# Altium schematic sheet CPU_GPIOA_F.SchDoc
size A4; Date: 2022-09-01; SheetNumber: 1; SheetTotal: 8
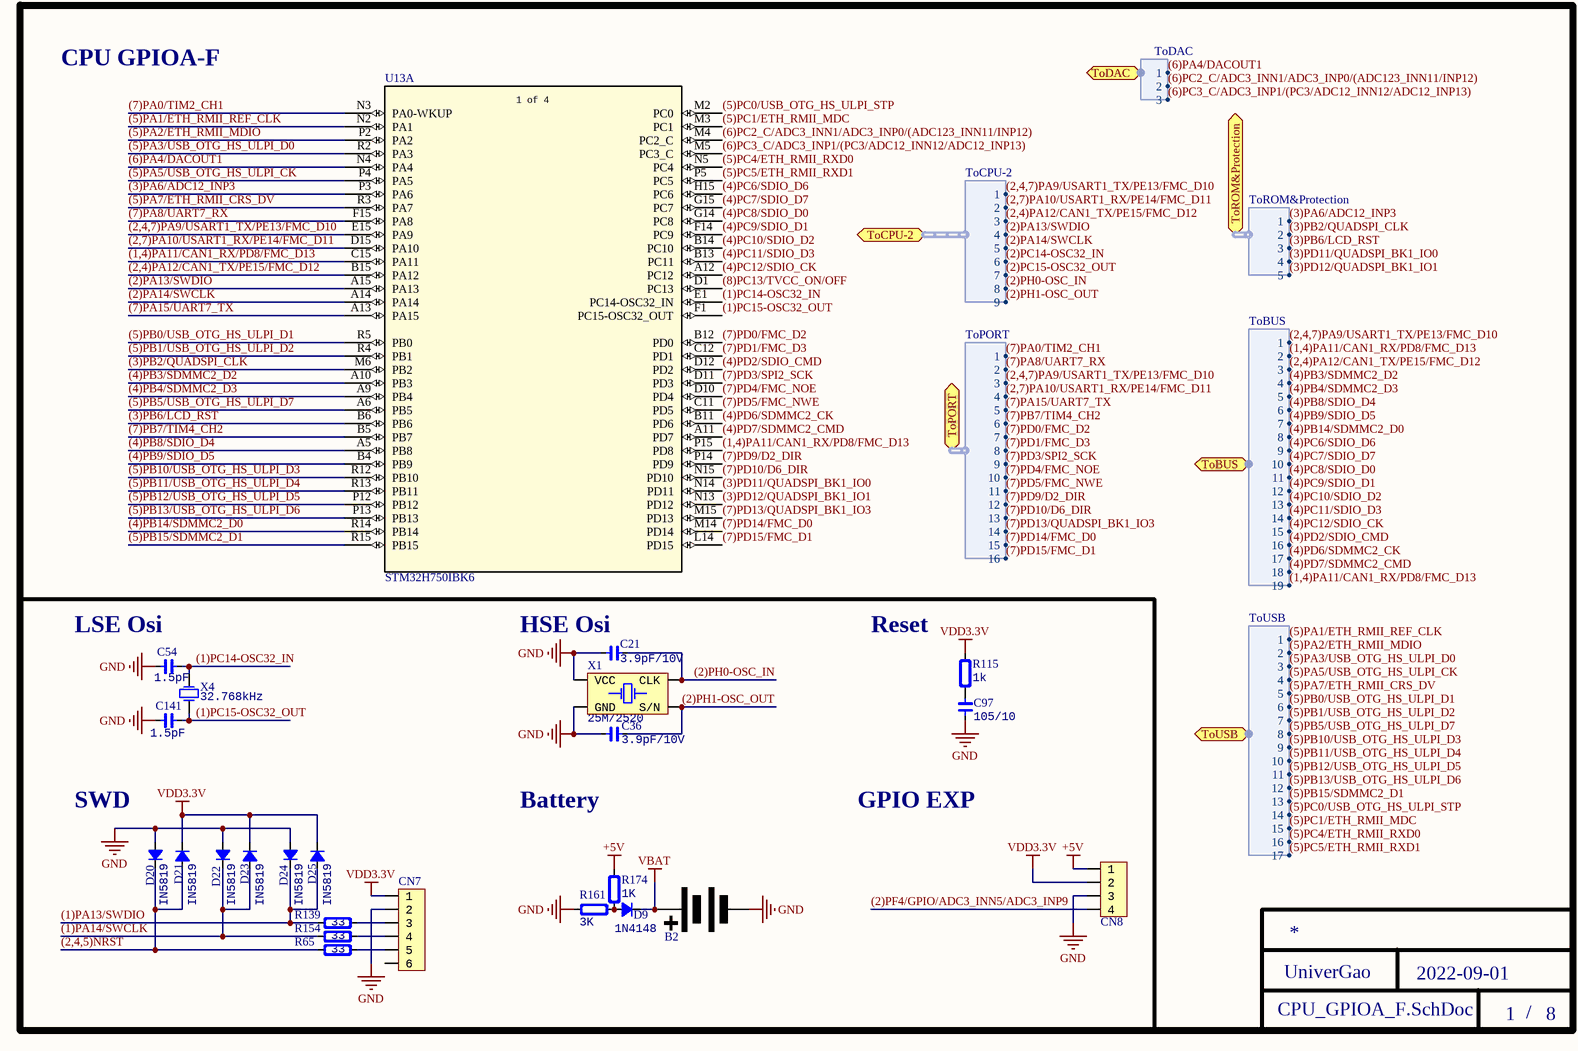
[diagram p0: CPU_GPIOA_F.SchDoc]

## Parts
B2  Battery  [CR2032-1]  (value not drawn)
C21  value 3.9pF/10V  [CAP_0603]  (hidden comment: C0603)
C36  value 3.9pF/10V  [CAP_0603]  (hidden comment: C0603)
C54  value 1.5pF  [CAP_0603]  (hidden comment: C0603)
C97  value 105/10  [CAP_0603]  (hidden comment: C0603)
C141  value 1.5pF  [CAP_0603]  (hidden comment: C0603)
CN7  HDR1x6  [HDR1X6_1.27_180]  (value not drawn)
CN8  HDR1x4  [HDR1X4_1.27_180]  (value not drawn)
D9  1N4148  [DO-214AC]
D20  (no value)  [SOD-323]
D21  (no value)  [SOD-323]
D22  (no value)  [SOD-323]
D23  (no value)  [SOD-323]
D24  (no value)  [SOD-323]
D25  (no value)  [SOD-323]
R65  value 33  [RES_0603]  (hidden comment: R0603)
R115  value 1k  [RES_0603]  (hidden comment: R0603)
R139  value 33  [RES_0603]  (hidden comment: R0603)
R154  value 33  [RES_0603]  (hidden comment: R0603)
R161  value 3K  [RES_0603]  (hidden comment: R0603)
R174  value 1K  [RES_0603]  (hidden comment: R0603)
U13  STM32H750IBK6  [UFBGA 10X10 P 0.65 176+25]  (part A of 4)
X1  value 25M/2520  [XT_2520_4]  (hidden comment: OSC2520)
X4  value 32.768kHz  [XT_2012_2]  (hidden comment: XTAL2012)

## Ports
ToBUS (harness ToBUS), ToCPU-2 (harness ToCPU-2), ToDAC (harness ToDAC), ToPORT (harness ToPORT), ToROM&Protection (harness ToROM&Protection), ToUSB (harness ToUSB)

## Harnesses
ToCPU-2: 1, 2, 3, 4, 5, 6, 7, 8, 9
ToROM&Protection: 1, 2, 3, 4, 5
ToBUS: 1, 2, 3, 4, 5, 6, 7, 8, 9, 10, 11, 12, 13, 14, 15, 16, 17, 18, 19
ToUSB: 1, 2, 3, 4, 5, 6, 7, 8, 9, 10, 11, 12, 13, 14, 15, 16, 17
ToDAC: 1, 2, 3
ToPORT: 1, 2, 3, 4, 5, 6, 7, 8, 9, 10, 11, 12, 13, 14, 15, 16

## Nets
+5V: CN8.1 R174.2
GND: B2.1(-) C21.1 C36.1 C54.1 C97.1 C141.1 CN7.2 CN8.3 D20.1(A) D22.1(A) D24.1(A) R161.2 X1.2(GND) X1.4(VCC)
VBAT: B2.2(+) D9.2(K)
VDD3.3V: CN7.1 CN8.2 D21.2(K) D23.2(K) D25.2(K) R115.2
(1)PA13/SWDIO: D24.2(K) D25.1(A) R139.1
(1)PA14/SWCLK: D22.2(K) D23.1(A) R154.1
(1)PC14-OSC32_IN: C54.2 U13.E1(PC14-OSC32_IN) X4.2(OSC2)
(1)PC15-OSC32_OUT: C141.2 U13.F1(PC15-OSC32_OUT) X4.1(OSC1)
(1,4)PA11/CAN1_RX/PD8/FMC_D13: U13.C15(PA11) U13.P15(PD8) ; port ToBUS.2, port ToBUS.19
(2)PA13/SWDIO: U13.A15(PA13) ; port ToCPU-2.4
(2)PA14/SWCLK: U13.A14(PA14) ; port ToCPU-2.5
(2)PC14-OSC32_IN: port ToCPU-2.6
(2)PC15-OSC32_OUT: port ToCPU-2.7
(2)PF4/GPIO/ADC3_INN5/ADC3_INP9: CN8.4
(2)PH0-OSC_IN: C21.2 X1.3(CLK) ; port ToCPU-2.8
(2)PH1-OSC_OUT: C36.2 X1.1(S/N) ; port ToCPU-2.9
(2,4)PA12/CAN1_TX/PE15/FMC_D12: U13.B15(PA12) ; port ToCPU-2.3, port ToBUS.3
(2,4,5)NRST: D20.2(K) D21.1(A) R65.1
(2,4,7)PA9/USART1_TX/PE13/FMC_D10: U13.E15(PA9) ; port ToCPU-2.1, port ToBUS.1, port ToPORT.3
(2,7)PA10/USART1_RX/PE14/FMC_D11: U13.D15(PA10) ; port ToCPU-2.2, port ToPORT.4
(3)PA6/ADC12_INP3: U13.P3(PA6) ; port ToROM&Protection.1
(3)PB2/QUADSPI_CLK: U13.M6(PB2) ; port ToROM&Protection.2
(3)PB6/LCD_RST: U13.B6(PB6) ; port ToROM&Protection.3
(3)PD11/QUADSPI_BK1_IO0: U13.N14(PD11) ; port ToROM&Protection.4
(3)PD12/QUADSPI_BK1_IO1: U13.N13(PD12) ; port ToROM&Protection.5
(4)PB3/SDMMC2_D2: U13.A10(PB3) ; port ToBUS.4
(4)PB4/SDMMC2_D3: U13.A9(PB4) ; port ToBUS.5
(4)PB8/SDIO_D4: U13.A5(PB8) ; port ToBUS.6
(4)PB9/SDIO_D5: U13.B4(PB9) ; port ToBUS.7
(4)PB14/SDMMC2_D0: U13.R14(PB14) ; port ToBUS.8
(4)PC6/SDIO_D6: U13.H15(PC6) ; port ToBUS.9
(4)PC7/SDIO_D7: U13.G15(PC7) ; port ToBUS.10
(4)PC8/SDIO_D0: U13.G14(PC8) ; port ToBUS.11
(4)PC9/SDIO_D1: U13.F14(PC9) ; port ToBUS.12
(4)PC10/SDIO_D2: U13.B14(PC10) ; port ToBUS.13
(4)PC11/SDIO_D3: U13.B13(PC11) ; port ToBUS.14
(4)PC12/SDIO_CK: U13.A12(PC12) ; port ToBUS.15
(4)PD2/SDIO_CMD: U13.D12(PD2) ; port ToBUS.16
(4)PD6/SDMMC2_CK: U13.B11(PD6) ; port ToBUS.17
(4)PD7/SDMMC2_CMD: U13.A11(PD7) ; port ToBUS.18
(5)PA1/ETH_RMII_REF_CLK: U13.N2(PA1) ; port ToUSB.1
(5)PA2/ETH_RMII_MDIO: U13.P2(PA2) ; port ToUSB.2
(5)PA3/USB_OTG_HS_ULPI_D0: U13.R2(PA3) ; port ToUSB.3
(5)PA5/USB_OTG_HS_ULPI_CK: U13.P4(PA5) ; port ToUSB.4
(5)PA7/ETH_RMII_CRS_DV: U13.R3(PA7) ; port ToUSB.5
(5)PB0/USB_OTG_HS_ULPI_D1: U13.R5(PB0) ; port ToUSB.6
(5)PB1/USB_OTG_HS_ULPI_D2: U13.R4(PB1) ; port ToUSB.7
(5)PB5/USB_OTG_HS_ULPI_D7: U13.A6(PB5) ; port ToUSB.8
(5)PB10/USB_OTG_HS_ULPI_D3: U13.R12(PB10) ; port ToUSB.9
(5)PB11/USB_OTG_HS_ULPI_D4: U13.R13(PB11) ; port ToUSB.10
(5)PB12/USB_OTG_HS_ULPI_D5: U13.P12(PB12) ; port ToUSB.11
(5)PB13/USB_OTG_HS_ULPI_D6: U13.P13(PB13) ; port ToUSB.12
(5)PB15/SDMMC2_D1: U13.R15(PB15) ; port ToUSB.13
(5)PC0/USB_OTG_HS_ULPI_STP: U13.M2(PC0) ; port ToUSB.14
(5)PC1/ETH_RMII_MDC: U13.M3(PC1) ; port ToUSB.15
(5)PC4/ETH_RMII_RXD0: U13.N5(PC4) ; port ToUSB.16
(5)PC5/ETH_RMII_RXD1: U13.P5(PC5) ; port ToUSB.17
(6)PA4/DACOUT1: U13.N4(PA4) ; port ToDAC.1
(6)PC2_C/ADC3_INN1/ADC3_INP0/(ADC123_INN11/INP12): U13.M4(PC2_C) ; port ToDAC.2
(6)PC3_C/ADC3_INP1/(PC3/ADC12_INN12/ADC12_INP13): U13.M5(PC3_C) ; port ToDAC.3
(7)PA0/TIM2_CH1: U13.N3(PA0-WKUP) ; port ToPORT.1
(7)PA8/UART7_RX: U13.F15(PA8) ; port ToPORT.2
(7)PA15/UART7_TX: U13.A13(PA15) ; port ToPORT.5
(7)PB7/TIM4_CH2: U13.B5(PB7) ; port ToPORT.6
(7)PD0/FMC_D2: U13.B12(PD0) ; port ToPORT.7
(7)PD1/FMC_D3: U13.C12(PD1) ; port ToPORT.8
(7)PD3/SPI2_SCK: U13.D11(PD3) ; port ToPORT.9
(7)PD4/FMC_NOE: U13.D10(PD4) ; port ToPORT.10
(7)PD5/FMC_NWE: U13.C11(PD5) ; port ToPORT.11
(7)PD9/D2_DIR: U13.P14(PD9) ; port ToPORT.12
(7)PD10/D6_DIR: U13.N15(PD10) ; port ToPORT.13
(7)PD13/QUADSPI_BK1_IO3: U13.M15(PD13) ; port ToPORT.14
(7)PD14/FMC_D0: U13.M14(PD14) ; port ToPORT.15
(7)PD15/FMC_D1: U13.L14(PD15) ; port ToPORT.16
(8)PC13/TVCC_ON/OFF: U13.D1(PC13)
NetC97_2: C97.2 R115.1
NetCN7_3: CN7.3 R139.2
NetCN7_4: CN7.4 R154.2
NetCN7_5: CN7.5 R65.2
NetD9_1: D9.1(A) R161.1 R174.1

Not connected (* = marked no-connect by the designer): CN7 6

## Notes on the sheet
- CPU GPIOA-F
- (near C54) LSE Osi
- (near C21) HSE Osi
- (near R115) Reset
- SWD
- Battery
- GPIO EXP
- UniverGao
- /
- (in symbol STM32H750IBK6, part A) 1 of 4

## Library data of the parts
C21 C36 C54 C97 C141 = Cap_0603: Capacitor; Specification: X7R, ±10%, 16V; Note: ±10%; Type: 0603; Manufacturer: *
CN7 = HDR1x6_1.27: Header; Value: 1.27; Type: DIP 1x6
CN8 = HDR1x4_1.27: Header; Value: 1.27; Type: DIP 1x4
D9 = Diode_SMA: Diode; Type: SMA; Manufacturer: *; Specification: *; Note: *; Value: 1N4148
D20-D25 = Diode_SOD323: Diode; Type: SOD323; Manufacturer: *; Specification: *; Note: *; IN5819: IN5819
R65 R115 R139 R154 R161 R174 = Res_0603: Resistor; Specification: ±1%; Manufacturer: *; Note: ±1%; Type: 0603
U13 = STM32H750IBK6: No Description Available; Mfr_Name: STMicroelectronics; Copyright: Copyright (C) 2022 Ultra Librarian. All rights reserved.; Manufacturer_Part_Number: STM32H750IBK6; RefDes: RefDes; Type: DEV
X1 = OSC_2520_4P: Crystal Oscillator; Specification: ±10ppm; Type: OSC2520_4P; Manufacturer: *; Note: *
X4 = XTAL_32.768k_2P: Crystal Oscillator; Specification: ±10ppm; Type: XTAL2012_2P; Manufacturer: *; Note: *